# EAGLE design Schematic with only shield (EAGLE 6.5.0)
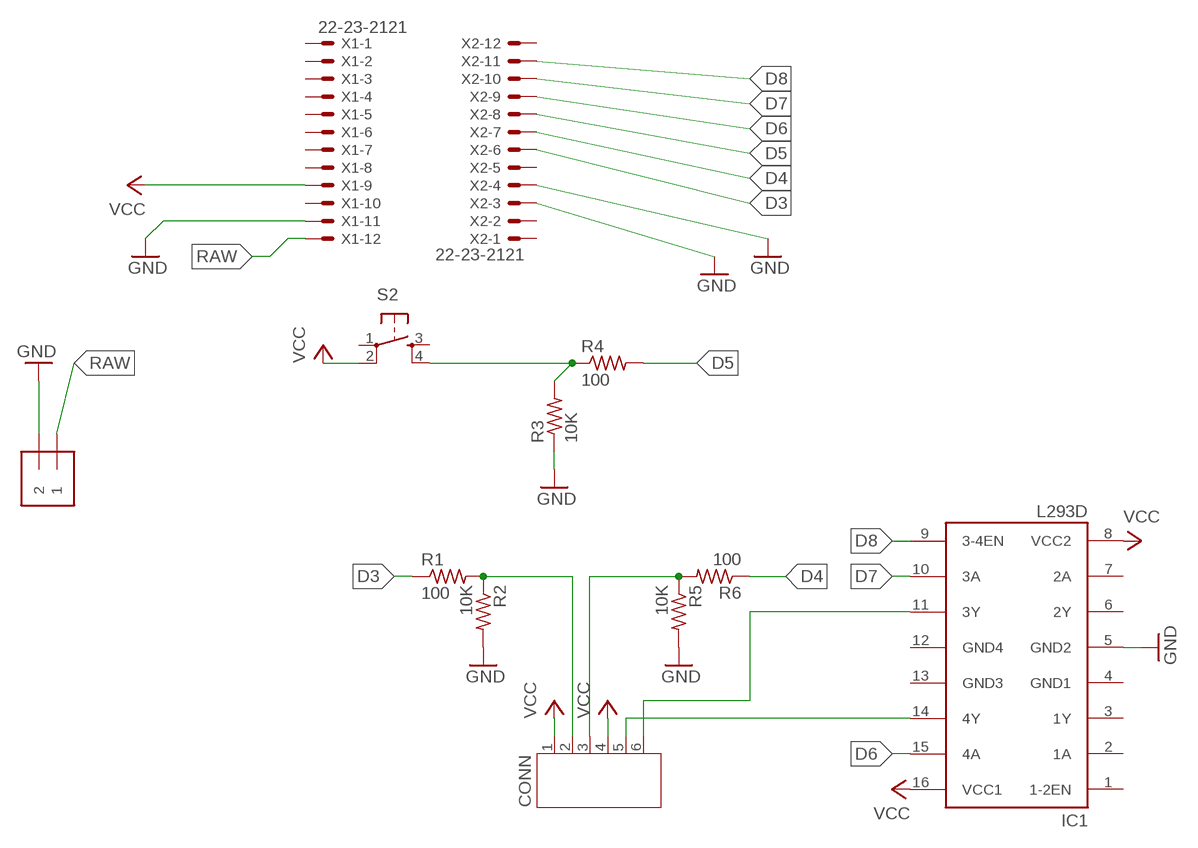
[diagram p0: schematic, sheet 1]

## Parts
CONN  JST-PH6  [JST-PH6]
IC1  L293D  [DIL16]
J1  1X2-3.5MM  [1X2-3.5MM]
R1  100  R-US_0204/7  [0204/7]
R2  10K  R-US_0204/7  [0204/7]
R3  10K  R-US_0204/7  [0204/7]
R4  100  R-US_0204/7  [0204/7]
R5  10K  R-US_0204/7  [0204/7]
R6  100  R-US_0204/7  [0204/7]
S2  TAC_SWITCHPTH  [TACTILE-PTH]
X1  22-23-2121  [22-23-2121]
X2  22-23-2121  [22-23-2121]

## Nets
D3: R1.1 X2.6
D4: R6.1 X2.7
D5: R4.2 X2.8
D6: IC1.15(4A) X2.9
D7: IC1.10(3A) X2.10
D8: IC1.9(3-4EN) X2.11
GND: IC1.5(GND2) J1.2 R2.2 R3.1 R5.2 X1.11 X2.3 X2.4
N$1: R3.2 R4.1 S2.4
N$2: CONN.3 R5.1 R6.2
N$3: CONN.2 R1.2 R2.1
N$4: CONN.6 IC1.11(3Y)
N$5: CONN.5 IC1.14(4Y)
RAW: J1.1 X1.12
VCC: CONN.1 CONN.4 IC1.8(VCC2) IC1.16(VCC1) S2.2 X1.9
Unconnected: IC1.1(1-2EN) IC1.2(1A) IC1.3(1Y) IC1.6(2Y) IC1.7(2A) S2.1 S2.3 X1.1 X1.2 X1.3 X1.4 X1.5 X1.6 X1.7 X1.8 X1.10 X2.1 X2.2 X2.5 X2.12

## Power pins joined to a net without a drawn wire
GND1: IC1.4(GND1)
GND3: IC1.13(GND3)
GND4: IC1.12(GND4)

## Library data of the parts
CONN = jst-ph:JST-PH6; OC_FARNELL: unknown
IC1 = st-microelectronics:L293D: PUSH-PULL 4 CHANNEL DRIVER; MF: TEXAS INSTRUMENTS; MPN: L293DNEE4; OC_FARNELL: 9589619; OC_NEWARK: 56P8249
J1 = adafruit:1X2: 3.5mm Terminal block http://www.ladyada.net/library/pcb/eaglelibrary.html
R1 R4 R6 = adafruit:R-US_: RESISTOR, American symbol; MF: STANLEY FAT MAX; MPN: 0-65-425; OC_FARNELL: 1520953
R2 R3 R5 = adafruit:R-US_: RESISTOR, American symbol; OC_FARNELL: unknown
S2 = SparkFun:TAC_SWITCH: Momentary Switch Button commonly used for reset or general input. Spark Fun Electronics SKU : COM-00097; OC_FARNELL: unknown
X1 X2 = con-molex:22-23-2121: .100" (2.54mm) Center Header - 12 Pin; MF: MOLEX; MPN: 22-23-2121; OC_FARNELL: 1462935; OC_NEWARK: 56H0456

## Net classes
0 Default: width 0.508 mm, drill 0.508 mm, clearance 0.457 mm

## Board
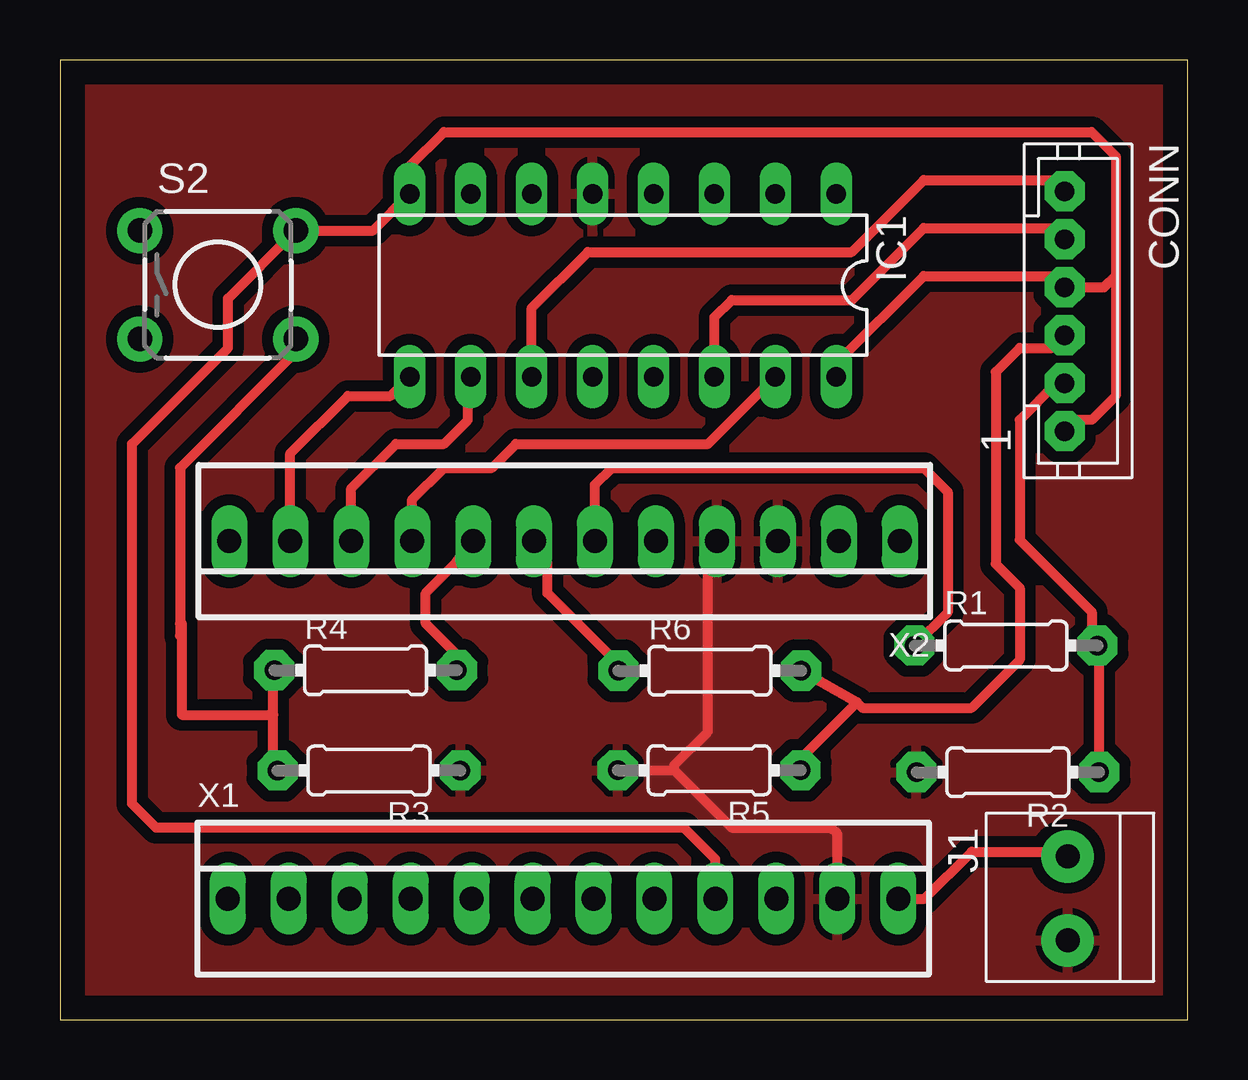
[diagram p1: board, top side]

Size 47 x 40 mm. Coordinates in mm from the lower left corner, seen from the top.
Outline: 0,0 47,0 47,40 0,40 0,0
Copper layers (1*16): Top 0.035mm / dielectric 1.5mm / Bottom 0.035mm
Design rules "default *": minimum track width 10mil, minimum drill 24mil, track to track 8mil, track to pad 10mil, pad to pad 10mil, via to via 8mil, smd to smd 8mil, copper to edge 40mil, drill to drill 12mil, minimum pad ring 10mil, minimum via ring 8mil, stop-mask expansion 4mil, vias tented up to drill 0mil, thermal gap 10mil

### Footprints (pad centres in the part's own frame; a part is rotated, then mirrored left to right if it is on the bottom)
JST-PH6 = drill 0.813 pad 1.676 octagon: 1 5,0; 2 3,0; 3 1,0; 4 -1,0; 5 -3,0; 6 -5,0
DIL16 = drill 0.813 long: 1 -8.89,-3.81; 2 -6.35,-3.81; 3 -3.81,-3.81; 4 -1.27,-3.81; 5 1.27,-3.81; 6 3.81,-3.81; 7 6.35,-3.81; 8 8.89,-3.81; 9 8.89,3.81; 10 6.35,3.81; 11 3.81,3.81; 12 1.27,3.81; 13 -1.27,3.81; 14 -3.81,3.81; 15 -6.35,3.81; 16 -8.89,3.81
1X2-3.5MM = drill 1 pad 2.184: 1 1.8,0; 2 -1.7,0
0204/7 = drill 0.813 pad 1.676 octagon: 1 -3.81,0; 2 3.81,0
TACTILE-PTH = drill 1.016 pad 1.88: 1 -3.251,2.261; 2 3.251,2.261; 3 -3.251,-2.261; 4 3.251,-2.261
22-23-2121 = drill 1 long: 1 -13.97,0; 2 -11.43,0; 3 -8.89,0; 4 -6.35,0; 5 -3.81,0; 6 -1.27,0; 7 1.27,0; 8 3.81,0; 9 6.35,0; 10 8.89,0; 11 11.43,0; 12 13.97,0

### Placement (x,y rotation side)
CONN  41.88,29.53 270 top
IC1  23.47,30.61 180 top
J1  42,5 90 top
R1  39.43,15.59 0 top
R2  39.51,10.31 180 top
R3  12.88,10.38 180 top
R4  12.74,14.56 0 top
R5  27.06,10.39 180 top
R6  27.09,14.54 0 top
S2  6.58,30.63 0 top
X1  20.97,5.04 0 top
X2  21.03,19.94 180 top

### Tracks (layer width: path | path; a pad name or v marks a point on that pad's centre or on a via)
D3
  Top 0.406: X2.6 22.3,22.3 23,23 36,23 37,22 37,16.97 R1.1
D4
  Top 0.406: R6.1 22.86,15.24 20.32,17.78 20.32,19.05 X2.7
D5
  Top 0.406: X2.8 16.51,19.05 15.24,17.78 15.24,16.51 16.51,15.24 R4.2
D6
  Top 0.406: X2.9 14.68,21.68 16,23 18,23 19,24 27.02,24 IC1.15
D7
  Top 0.406: X2.10 12.14,22.14 14,24 16,24 17,25 17,26.68 IC1.10
D8
  Top 0.406: X2.11 9.6,23.6 12,26 13.78,26 IC1.9
GND
  Top 0.406: 24.51,10.38 R5.2 25.61,10.39 | X1.11 32.4,7.74 32.14,8 28,8 25.61,10.39 | 25.61,10.39 25.61,10.61 27,12 27,19.56 X2.4
  pour Top: 1,39 46,39 46,1 1,1
N$1
  Top 0.406: S2.4 9.83,27.83 5,23 5,16.51 | 5,16.51 5,16 | 8.89,12.7 8.89,10.16 R3.2 | 8.89,12.7 8.89,13.97 R4.1 | 8.89,12.7 5.08,12.7 5.08,16.51 5,16.51
N$2
  Top 0.406: CONN.3 41.35,28 40,28 39,27 39,19 40,18 40,15 38,13 33.44,13 33.22,13.22 | 33.22,13.22 R6.2 | R5.1 30.87,10.87 33.22,13.22
N$3
  Top 0.406: CONN.2 41.53,26.53 40,25 40,20 43,17 43,15.83 R1.2 43.32,15.51 R2.1
N$4
  Top 0.406: IC1.11 19.66,29.66 22,32 33,32 36,35 41.41,35 CONN.6
N$5
  Top 0.406: IC1.14 27.28,29.28 28,30 33,30 36,33 41.41,33 CONN.5
RAW
  Top 0.406: X1.12 36.04,5.04 38,7 41.8,7 J1.1
VCC
  Top 0.406: X1.9 27.32,6.68 26,8 4,8 3,9 3,24 7,28 7,30.06 S2.2 13.05,32.89 IC1.8 14.58,35.58 16,37 43,37 44,36 44,31 | IC1.16 32.36,27.36 36,31 41.41,31 CONN.4 43.53,30.53 44,31 | 44,31 44,26 43,25 42.35,25 CONN.1